# Altium project UL-SWAP-DAQ-1.PrjPcb (part 2 of 2)

## Sheet PIC32_Subsystem.SchDoc
size A; SheetNumber: 5; SheetTotal: 15
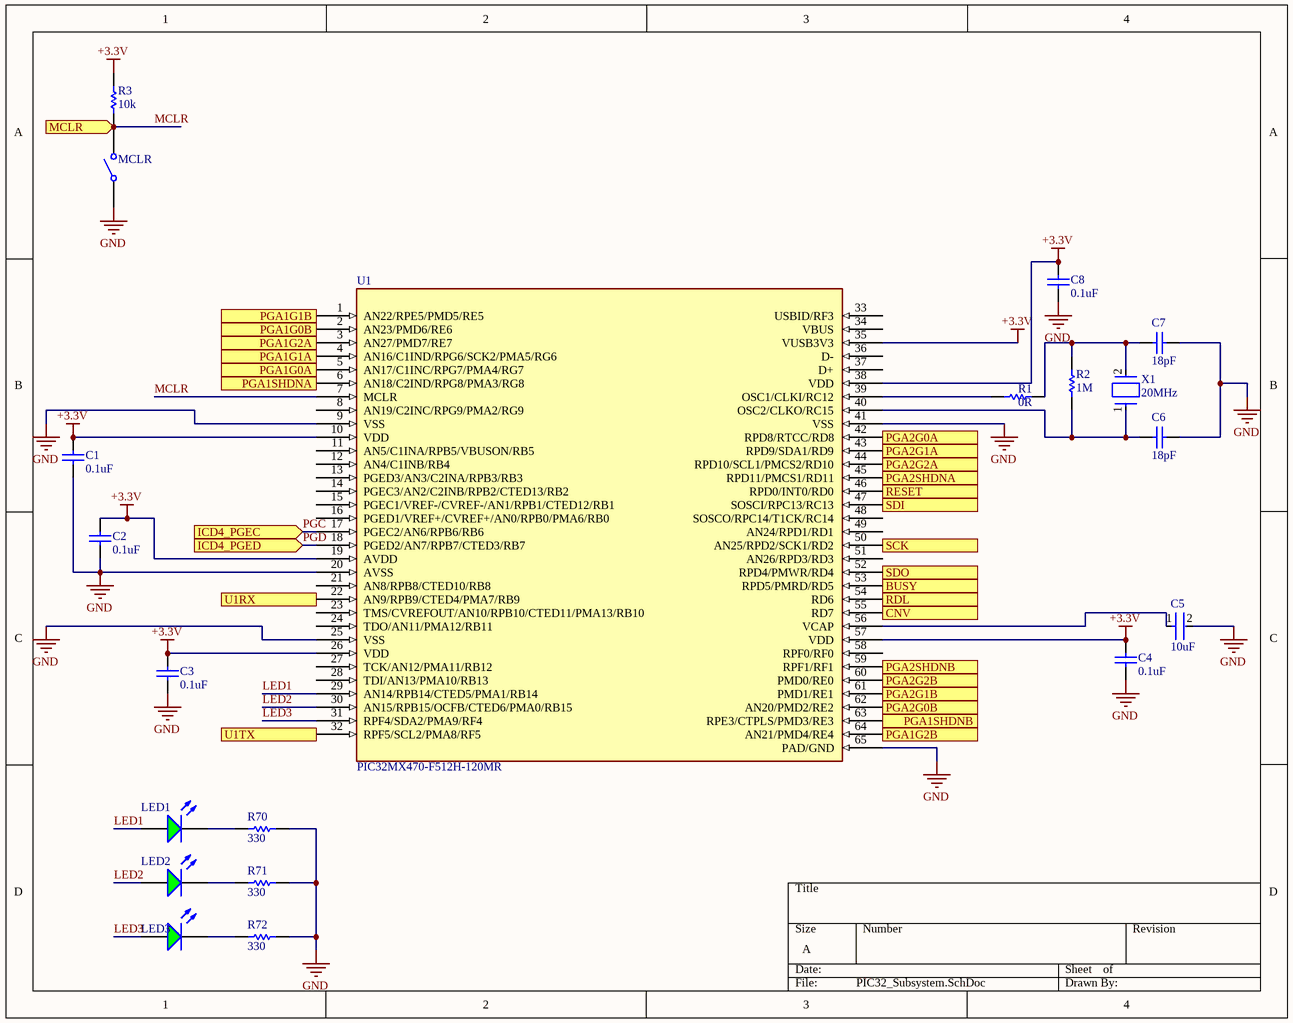
[diagram p8: PIC32_Subsystem.SchDoc]

### Parts
C1  0.1uF  [CAPC1050X55X23ML05T13]
C2  0.1uF  [CAPC1050X55X23ML05T13]
C3  0.1uF  [CAPC1050X55X23ML05T13]
C4  0.1uF  [CAPC1050X55X23ML05T13]
C5  10uF  [FP-GRM188-0_1-e0_2_0_55-IPC_A]
C6  18pF  [CAPC1005X55X25LL05T10]
C7  18pF  [CAPC1005X55X25LL05T10]
C8  0.1uF  [CAPC1050X55X23ML05T13]
LED1  (no value)  [KING-APT1608SGC_V]
LED2  (no value)  [KING-APT1608SGC_V]
LED3  (no value)  [KING-APT1608SGC_V]
MCLR  434121043816  [434121043816]  (value not drawn)
R1  0R  [RESC1005X40X25NL05T10]
R2  1M  [RESC1005X40X25LL05T05]
R3  10k  [RESC1005X40X25LL05T05]
R70  330  [RESC1609X50X30LL10T20]
R71  330  [RESC1609X50X30LL10T20]
R72  330  [RESC1609X50X30LL10T20]
U1  PIC32MX470-F512H-120MR  [TQFP]
X1  20MHz  [FP-ABM7-MFG]

### Ports
BUSY (in), CNV (out), ICD4_PGEC (in), ICD4_PGED (in), MCLR (in), PGA1G0A (out), PGA1G0B (out), PGA1G1A (out), PGA1G1B (out), PGA1G2A (out), PGA1G2B (out), PGA1SHDNA (out), PGA1SHDNB (out), PGA2G0A (out), PGA2G0B (out), PGA2G1A (out), PGA2G1B (out), PGA2G2A (out), PGA2G2B (out), PGA2SHDNA (out), PGA2SHDNB (out), RDL (out), RESET (out), SCK (out), SDI (in), SDO (out), U1RX (in), U1TX (out)

### Nets
+3.3V: C1.2 C2.2 C3.2 C4.2 C8.2 R3.2 U1.10(VDD) U1.19(AVDD) U1.26(VDD) U1.35(VUSB3V3) U1.38(VDD) U1.57(VDD)
GND: C1.1 C2.1 C3.1 C4.1 C5.2 C6.2 C7.2 C8.1 MCLR.1 R70.2 R71.2 R72.2 U1.9(VSS) U1.20(AVSS) U1.25(VSS) U1.41(VSS) U1.65(PAD/GND)
A_GP0: U1.42(RPD8/RTCC/RD8) ; port PGA2G0A
A_GP1: U1.43(RPD9/SDA1/RD9) ; port PGA2G1A
A_GP2: U1.44(RPD10/SCL1/PMCS2/RD10) ; port PGA2G2A
ADCSDI_PIC32SDO: U1.52(RPD4/PMWR/RD4) ; port SDO
ADCSDO_PIC32SDI: U1.47(SOSCI/RPC13/RC13) ; port SDI
B_GP0: U1.62(AN20/PMD2/RE2) ; port PGA2G0B
B_GP1: U1.61(PMD1/RE1) ; port PGA2G1B
B_GP2: U1.60(PMD0/RE0) ; port PGA2G2B
BUSY: U1.53(RPD5/PMRD/RD5) ; port BUSY
C_GP0: U1.2(AN23/PMD6/RE6) ; port PGA1G0B
C_GP1: U1.1(AN22/RPE5/PMD5/RE5) ; port PGA1G1B
C_GP2: U1.64(AN21/PMD4/RE4) ; port PGA1G2B
CNV: U1.55(RD7) ; port CNV
D_GP0: U1.5(AN17/C1INC/RPG7/PMA4/RG7) ; port PGA1G0A
D_GP1: U1.4(AN16/C1IND/RPG6/SCK2/PMA5/RG6) ; port PGA1G1A
D_GP2: U1.3(AN27/PMD7/RE7) ; port PGA1G2A
LED1: LED1.1(A) U1.29(AN14/RPB14/CTED5/PMA1/RB14)
LED2: LED2.1(A) U1.30(AN15/RPB15/OCFB/CTED6/PMA0/RB15)
LED3: LED3.1(A) U1.31(RPF4/SDA2/PMA9/RF4)
MCLR: MCLR.2 R3.1 U1.7(MCLR) ; port MCLR
PGC: U1.17(PGEC2/AN6/RPB6/RB6) ; port ICD4_PGEC
PGD: U1.18(PGED2/AN7/RPB7/CTED3/RB7) ; port ICD4_PGED
RDL: U1.54(RD6) ; port RDL
RESET: U1.46(RPD0/INT0/RD0) ; port RESET
SCK: U1.50(AN25/RPD2/SCK1/RD2) ; port SCK
SHDN-A: U1.45(RPD11/PMCS1/RD11) ; port PGA2SHDNA
SHDN-B: U1.59(RPF1/RF1) ; port PGA2SHDNB
SHDN-C: U1.63(RPE3/CTPLS/PMD3/RE3) ; port PGA1SHDNB
SHDN-D: U1.6(AN18/C2IND/RPG8/PMA3/RG8) ; port PGA1SHDNA
U1TX: U1.32(RPF5/SCL2/PMA8/RF5) ; port U1TX
NetC5_1: C5.1 U1.56(VCAP)
NetC6_1: C6.1 R2.1 U1.40(OSC2/CLKO/RC15) X1.1
NetC7_1: C7.1 R1.2 R2.2 X1.2
NetLED1_2: LED1.2(K) R70.1
NetLED2_2: LED2.2(K) R71.1
NetLED3_2: LED3.2(K) R72.1
NetR1_1: R1.1 U1.39(OSC1/CLKI/RC12)
NetU1_22: U1.22(AN9/RPB9/CTED4/PMA7/RB9) ; port U1RX

Not connected (* = marked no-connect by the designer): U1 8(AN19/C2INC/RPG9/PMA2/RG9) 11(AN5/C1INA/RPB5/VBUSON/RB5) 12(AN4/C1INB/RB4) 13(PGED3/AN3/C2INA/RPB3/RB3) 14(PGEC3/AN2/C2INB/RPB2/CTED13/RB2) 15(PGEC1/VREF-/CVREF-/AN1/RPB1/CTED12/RB1) 16(PGED1/VREF+/CVREF+/AN0/RPB0/PMA6/RB0) 21(AN8/RPB8/CTED10/RB8) 23(TMS/CVREFOUT/AN10/RPB10/CTED11/PMA13/RB10) 24(TDO/AN11/PMA12/RB11) 27(TCK/AN12/PMA11/RB12) 28(TDI/AN13/PMA10/RB13) 33(USBID/RF3) 34(VBUS) 36(D-) 37(D+) 48(SOSCO/RPC14/T1CK/RC14) 49(AN24/RPD1/RD1) 51(AN26/RPD3/RD3) 58(RPF0/RF0)

### Library data of the parts
C1-C4 C8 = CMP-2000-05439-1: Chip Capacitor, 100 nF, +/- 10%, 16 V, -55 to 125 degC, 0402 (1005 Metric), RoHS, Tape and Reel / CL05B104KO5NNNC; Manufacturer: Samsung Electro-Mechanics; Capacitance: 100000pF; Dielectric: X7R; Rated Voltage: 16V; Case Size/Dimension: 0402; Tolerance (%): ±10%; Manufacturer URL: http://www.samsungsem.com/global/index.jsp; Datasheet URL: https://datasheet.ciiva.com/29198/458718-da-01-en-vs-kondensator-0402-29198423.pdf; Datasheet Version: Nov-10
C5 = CMP-2006-02792-2: Chip Multilayer Ceramic Capacitors for General Purpose, 0603, 10uF, X5R, 15%, 20%, 6.3V / GRM188R60J106ME47D; Packaging: Tape and Reel; Voltage Rating (DC): 6.3V; Width: 0.031inch; Termination: SMD/SMT; Dielectric: X5R; Package Quantity: 4000; Voltage Rating: 6.3V; Capacitance: 10uF; Case/Package: 0603; Min Operating Temperature: -55°C; Voltage: 6.3V; Length: 1.6mm; Thickness: 0.035inch; Lead Free: Lead Free; Depth: 0.8mm; Case Code (Imperial): 0603; Max Operating Temperature: 85°C; Material: Ceramic; Height: 0.8mm; Tolerance: 20%; Mount: Surface Mount; REACH SVHC: No SVHC; Radiation Hardening: No; Case Code (Metric): 1608
C6 C7 = CMP-2008-04271-1: GRM1555C1H180GA01D; Manufacturer: Murata; Part Number: GRM1555C1H180GA01D
LED1-LED3 = CMP-2000-05789-1: Super Bright Green LED, 62.5 mW, 25 mA, -40 to 85 degC, 2-Pin SMD, RoHS, Tape and Reel, APT1608SGC; Manufacturer: Kingbright; Online Catalog: 0603RectanglewithFlatTopChipLEDs; Wavelength - Dominant: 568nm; Wavelength - Peak: 565nm; Voltage - Forward (Vf) (Typ): 2.2V; Lens Type: Clear; Other Names: 754-1121-2; Millicandela Rating: 15mcd; Catalog Drawings: APT1608SeriesTop / APT1608SeriesSide; Lens Style/Size: RectanglewithFlatTop,1.2mmx0.8mm; Current - Test: 20mA; 3D Model: APT1608x.sldprt / APT1608x.pro / APT1608x.igs / APT1608x.stp; Viewing Angle: 120°; Package / Case: 0603(1608Metric); Category: Optoelectronics; Package Description: 2-Pin Surface Mount Device, Body 0.8 x 1.6 mm; Mounting Type: SurfaceMount; Color: Green; Height: 0.75mm; Datasheet Version: Rev. 16B, 02/2012; Family: LEDIndication-Discrete; Manufacturer URL: http://www.kingbright.com/; Package Reference: APT1608SGC; Datasheet URL: https://datasheet.ciiva.com/2113/apt1608sgc-2113808.pdf; Mounting Technology: SurfaceMount; Packaging: Tape&Reel(TR); Standard Package: 2,000; Size / Dimension: 1.60mmLx0.80mmW
MCLR = CMP-1459-00005-1: WS-TASV SMD Tact Switch 6.0X3.5 mm; Manufacturer: Wuerth Elektronik; NoPins: 02; ComponentLink1URL: http://www.we-online.com; PartNumber: 434121043816; ComponentLink2URL: http://katalog.we-online.de/em/datasheet/434121043816.pdf; ComponentLink2Description: Datasheet; ComponentLink1Description: Manufacturer URL; PackageReference: 434121043816
R1 = CMP-1011-00001-2: RC0402JR-070RL; Manufacturer: Yageo / Phycomp; Part Number: RC0402JR-070RL
R2 = CMP-2002-00609-3: Chip Resistor, 1 MOhm, +/- 1%, 100 mW, -55 to 155 degC, 0402 (1005 Metric), RoHS, Tape and Reel / ERJ-2RKF1004X; Manufacturer: Basic Passives; Voltage Rating: 50 V; Case\/Package: 0402; Resistance: 1 MOhm; Power Rating: 100 mW; Pins: 2; Max Operating Temperature: 155 degC; ComponentLink2URL: http://industrial.panasonic.com/cdbs/www-data/pdf/RDA0000/AOA0000C86.pdf; Weight: 2.8E-05oz; ComponentLink1URL: http://www.panasonic.com/; Radiation Hardening: No; Height: 0.35 mm; Case Code (Imperial): 0402; ComponentLink2Description: Datasheet; Mount: Surface Mount; ComponentLink1Description: Manufacturer URL; REACH SVHC: Yes; PartNumber: ERJ-2RKF1004X; Length: 1 mm; Min Operating Temperature: -55 degC; Width: 0.5 mm; Package Quantity: 10000; Tolerance: 1%; PackageDescription: 2-Pin Surface Mount Device, Body 1 x 0.5 mm; RoHSCompliant: true; DatasheetVersion: 04/2015; PackageReference: 0402; Mounting Technology: Surface Mount; Case Code (Metric): 1005; Packaging: Tape and Reel
R3 = CMP-2000-07588-1: Chip Resistor, 10 KOhm, +/- 1%, 0.1 W, -55 to 155 degC, 0402 (1005 Metric), RoHS, Tape and Reel / ERJ2RKF1002X; Manufacturer: Panasonic; Power Rating: 100mW; Voltage Rating: 50V; Resistance: 10KOhm; Case\/Package: 0402; Temperature Coefficient: 100ppm\/degreesC; RoHSCompliant: True; Lead Free: LeadFree; Package Quantity: 1; Contact Plating: Tin; Length: 1mm; Radiation Hardening: No; REACH SVHC: NoSVHC; Max Operating Temperature: 155degC; Depth: 0.5mm; Case Code (Imperial): 0402; Military Standard: Not; Package Description: 2-Pin Surface Mount Device, Body 1 x 0.5 mm; Termination: SMD/SMT; Case Code (Metric): 1005; Height: 0.35mm; Packaging: TapeandReel; Voltage Rating (DC): 50V; Package Reference: 402; Number of Pins: 2; Tolerance: 1%; Mounting Technology: SurfaceMount; Width: 0.02inch; Mount: SurfaceMount; Datasheet URL: https://industrial.panasonic.com/cdbs/www-data/pdf/RDA0000/AOA0000C304.pdf; Composition: ThickFilm; Datasheet Version: 02/2017; Manufacturer URL: http://www.panasonic.com/; Max Power Dissipation: 100mW; Number of Terminations: 2; Min Operating Temperature: -55degC
R70-R72 = CMP-1012-00062-2: CRCW0603330RJNEA; Manufacturer: Vishay Dale; Part Number: CRCW0603330RJNEA
X1 = CMP-27762-013587-1: Crystal 20MHz ±20ppm 18pF SMD-2 6mm x 3.5mm / ABM7-20.000MHZ-D2Y-T; Frequency Stability: 30ppm; ESR (Equivalent Series Resistance): 50R; Contact Plating: Gold; Load Capacitance: 18pF; Tolerance: 20ppm; Length: 6mm; Frequency: 20MHz; Lead Free: Lead Free; Package Quantity: 1000; Resistor Type: Ceramic; Min Operating Temperature: -40°C; Max Operating Temperature: 85°C; Series: ABM7; Depth: 3.5mm; Width: 0.138inch; Frequency Tolerance: 20ppm; Termination: SMD/SMT; Radiation Hardening: No; Case/Package: CSMD; Height: 0.055inch; Packaging: Tape and Reel; Operating Frequency: 20 MHz; Series Resistance: 50R; Number of Pins: 2; Mount: Surface Mount

## Sheet LVDS_Driver_Subsystem.SchDoc
size A; SheetNumber: 4; SheetTotal: 16
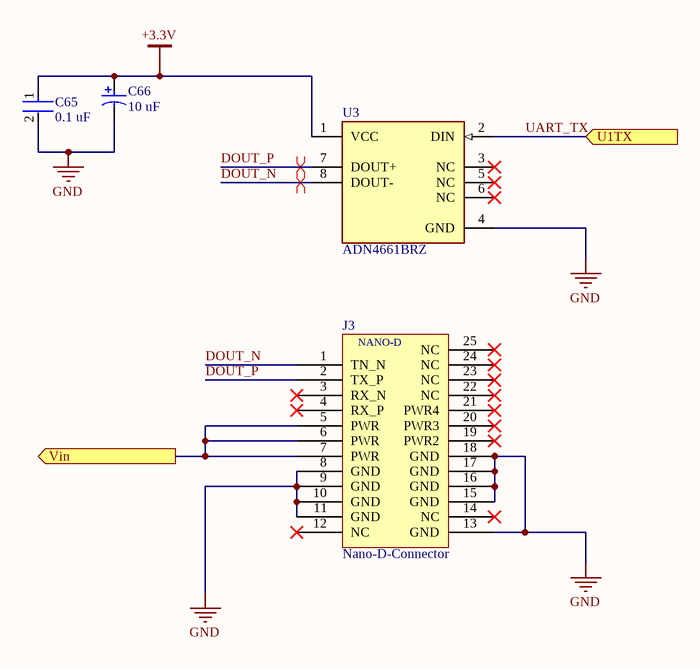
[diagram p9: LVDS_Driver_Subsystem.SchDoc]

### Parts
C65  0.1 uF  [FP-CC0603-DA-MFG]
C66  10 uF  [VISH-TR8-M_L]
J3  Nano-D-Connector  [A28400-025]
U3  ADN4661BRZ  [FP-R-8-IPC_A]

### Ports
U1TX (in), Vin (out)

### Nets
+3.3V: C65.1 C66.1 U3.1(VCC)
GND: C65.2 C66.2 J3.8(GND) J3.9(GND) J3.10(GND) J3.11(GND) J3.13(GND) J3.15(GND) J3.16(GND) J3.17(GND) J3.18(GND) U3.4(GND)
DOUT_N: J3.1(TN_N) U3.8(DOUT-)
DOUT_P: J3.2(TX_P) U3.7(DOUT+)
UART_TX: U3.2(DIN) ; port U1TX  [project net U1TX]
Vin: J3.5(PWR) J3.6(PWR) J3.7(PWR) ; port Vin

Not connected (* = marked no-connect by the designer): J3 3(RX_N)* 4(RX_P)* 12(NC)* 14(NC)* 19(PWR2)* 20(PWR3)* 21(PWR4)* 22(NC)* 23(NC)* 24(NC)* 25(NC)*; U3 3(NC)* 5(NC)* 6(NC)*

### Layout directives
differential pair: DOUT_N, DOUT_P

### Notes on the sheet
- (in symbol Nano-D-Connector) NANO-D

### Library data of the parts
C65 = CMP-2000-05002-2: CAP CER 0.1UF 16V X7R 0603 CC0603KRX7R7BB104; Manufacturer: YAGEO; Tolerance: 0.1; Value: 100 nF; Temperature Coefficient: 15%; Material: Ceramic; Voltage Rating: 16 V; Package: CC0603-DA; ComponentLink2Description: Datasheet; Octopart: https://octopart.com/cc0603krx7r7bb104-yageo-192941; Temperature Range High: +125°C; Digikey Description: CAP CER 0.1UF 16V X7R 0603; Voltage: 16 V; Device Class L2: Capacitors; Height: 0.9mm; Temperature: -55°C to +125°C; Manufacturer Part Number: CC0603KRX7R7BB104; Device Class L1: Passive Components; Device Class L3: Ceramic Capacitors; ComponentLink2URL: http://www.yageo.com/documents/recent/UPY-GPHC_X7R_6.3V-to-50V_18.pdf; Footprint Url: http://www.yageo.com/exep/pages/download/literatures/UPY-C_GEN_24.pdf; RoHS: TRUE; Temperature Range Low: -55°C; Temperature Characteristic: X7R; Lead Free: Yes; Capacitance: 100 nF; Category: Cap; Mouser Description: Multilayer Ceramic Capacitor, CC Series, 0.1 - F, - 10%, X7R, 16 V, 0603 [1608 Metric]; Automotive: No
C66 = CMP-2000-07316-1: Tantalum Capacitor, 10 uF, +/- 20%, 10 V, -55 to 125 degC, 2-Pin SMD (M), RoHS, Tape and Reel TR8M106M010C2000; Manufacturer: Vishay; Capacitance: 10µF; Featured Product: TR8SeriesMoldedMicroTan™TantalumChipCapacitors; ESR (Equivalent Series Resistance): 2Ohm; Other Names: 718-1673-6; Catalog Drawings: TR8SeriesTR8SeriesBottom; Online Catalog: MICROTAN®TR8Series; Voltage - Rated: 10V; Type: Molded; Mounting Technology: SurfaceMount; Category: Capacitors; Lifetime @ Temp.: -; Package Reference: TR8-M; Size / Dimension: 0.063"Lx0.033"W(1.60mmx0.85mm); Operating Temperature: -55°C~125°C; Mounting Type: SurfaceMount; Lead Spacing: -; Tolerance: ±20%; Standard Package: 1; Datasheet URL: http://www.vishay.com/docs/40114/tr8.pdf; Package Description: 2-Pin Surface Mount Device, Body 1.6 x 0.85 mm; Height - Seated (Max): 0.035"(0.89mm); Family: TantalumCapacitors; Manufacturer Size Code: M; Series: MICROTAN®TR8; Packaging: Digi-Reel®; Manufacturer URL: http://www.vishay.com/; Datasheet Version: 03/2016; Package / Case: 0603(1608Metric); Features: GeneralPurpose
U3 = CMP-09093-000114-1: IC DRIVER 1/0 8SOIC; Supply Current: 7mA; Number of Receivers: 1; Min Supply Voltage: 3V; Max Supply Current: 10mA; Max Supply Voltage: 3.6V; Turn-On Delay Time: 1.5ns; Data Rate: 600Mbps; Operating Supply Voltage: 3.3V; Length: 5mm; Series: -; Number of Pins: 8; REACH SVHC: No SVHC; Mount: Surface Mount; RoHS Compliant: Yes; Packaging: Rail/Tube; Nominal Supply Current: 7mA; Radiation Hardening: No; Number of Drivers: 1; Width: 4mm; Number of Elements: 1; Lead Free: Contains Lead; Operating Supply Current: 7mA; Min Operating Temperature: -40°C; Propagation Delay: 1.5ns; Package Quantity: 98; Height: 1.5mm; Case/Package: SOIC; Max Operating Temperature: 85°C

## Sheet ICD4_Interface_Module.SchDoc
size A; SheetNumber: 6; SheetTotal: 15
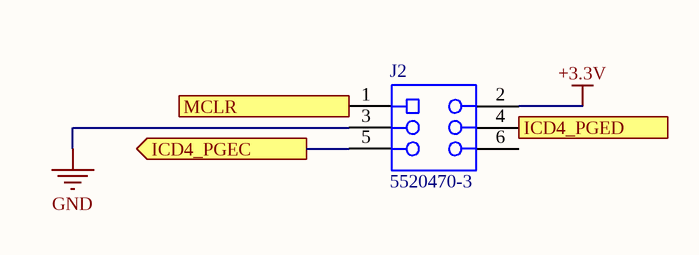
[diagram p10: ICD4_Interface_Module.SchDoc]

### Parts
J2  5520470-3  [TECO-5520470-3_V]

### Ports
ICD4_PGEC (out), ICD4_PGED (out), MCLR (out)

### Nets
+3.3V: J2.2
GND: J2.3
MCLR: J2.1 ; port MCLR
PGC: J2.5 ; port ICD4_PGEC
PGD: J2.4 ; port ICD4_PGED

Not connected (* = marked no-connect by the designer): J2 6

### Library data of the parts
J2 = CMP-1682-00001-5: Modular Jack, 6 Position, Right Angle, RoHS, Tray; Manufacturer: TE Connectivity; Voltage Rating: 150 V; Current Rating: 1.5 A; Lead Pitch: 2.54 mm; Contact Material: Bronze; RoHSCompliant: true; Contact Finish: Gold; REACH SVHC: Unknown; Height: 16.13 mm; Colour: Black; ComponentLink1Description: Manufacturer URL; PackageDescription: Female Header, Pitch 1.27 mm, 2 x 3 Position, Height 16.13 mm, Tail Length 4.32 mm; ComponentLink2URL: http://www.te.com/commerce/DocumentDelivery/DDEController?Action=srchrtrv&DocNm=5520470&DocType=Customer+Drawing&DocLang=English; ComponentLink2Description: Datasheet; Package Quantity: 176; Pins: 6; Length: 13.34 mm; Packaging: Tray; Contact Plating: Gold; Housing Material: PBT; Max Voltage Rating (AC): 150 V; ComponentLink1URL: http://www.te.com/; Mount: Through Hole; DatasheetVersion: Rev. B1, 03/2011; PackageReference: 5520470-3; Mounting Technology: Through Hole

## Sheet 403mainschematic.SchDoc
size A; SheetNumber: 7; SheetTotal: 15
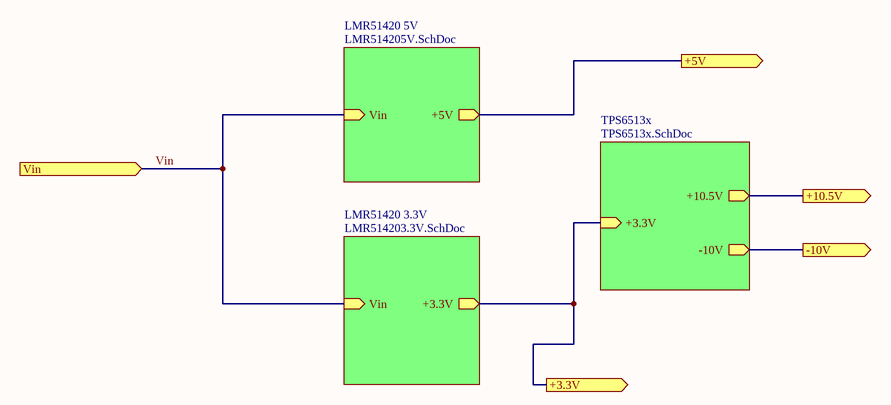
[diagram p11: 403mainschematic.SchDoc]

### Sub-sheets
LMR51420 3.3V = LMR514203.3V.SchDoc: Vin (in), +3.3V (out)
LMR51420 5V = LMR514205V.SchDoc: Vin (in), +5V (out)
TPS6513x = TPS6513x.SchDoc: +3.3V (in), +10.5V (out), -10V (out)

### Ports
+3.3V (out), +5V (out), +10.5V (out), -10V (out), Vin (in)

### Nets
+3.3V: port +3.3V, sheet LMR51420 3.3V/+3.3V, sheet TPS6513x/+3.3V
+5V: port +5V, sheet LMR51420 5V/+5V
+10.5V: port +10.5V, sheet TPS6513x/+10.5V
-10V: port -10V, sheet TPS6513x/-10V
Vin: port Vin, sheet LMR51420 3.3V/Vin, sheet LMR51420 5V/Vin

## Sheet LMR514203.3V.SchDoc
size A; SheetNumber: 10; SheetTotal: 15
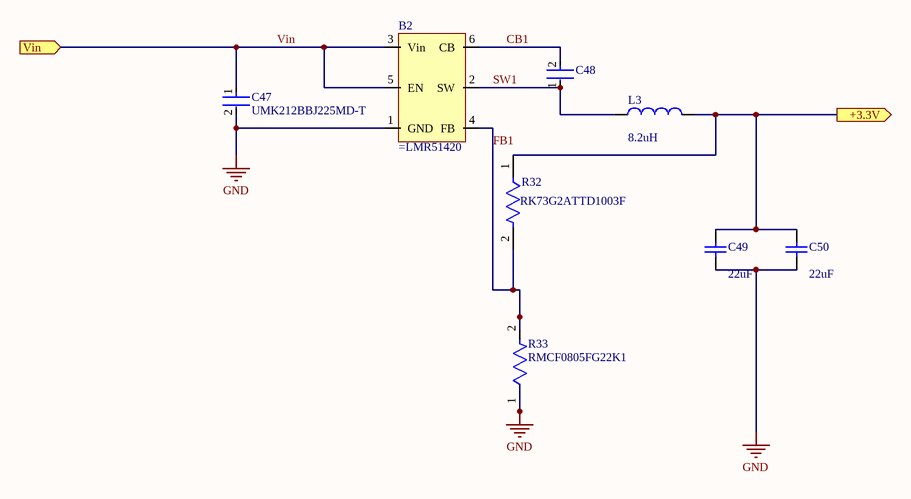
[diagram p12: LMR514203.3V.SchDoc]

### Parts
B2  (no value)  [LMR51420IC]
C47  UMK212BBJ225MD-T  [FP-0805-L_2_0_0_2-W_1_25-IPC_A]
C48  C0603C104K4PAC7867  [CAP CER 0.1UF 16V X7R 0603]  (value not drawn)
C49  value 22uF  [Cap22uF_C1206C226M4PAC7800]  (hidden comment: Comment)
C50  value 22uF  [Cap22uF_C1206C226M4PAC7800]  (hidden comment: Comment)
L3  value 8.2uH  [MSS1246H-103MED 10uH]  (hidden comment: MSS1260H-822MED)
R32  RK73G2ATTD1003F  [FP-RK73G2A-IPC_A]
R33  RMCF0805FG22K1  [FP-RMCF0805-IPC_B]

### Ports
+3.3V (out), Vin (in)

### Nets
+3.3V: C49.2 C50.2 L3.2 R32.1 ; port +3.3V
GND: B2.1(GND) C47.2 C49.1 C50.1 R33.1
CB1: B2.6(CB) C48.2
FB1: B2.4(FB) R32.2 R33.2
SW1: B2.2(SW) C48.1 L3.1
Vin: B2.3(Vin) B2.5(EN) C47.1 ; port Vin

### Library data of the parts
B2 = Component_1
C47 = CMP-14477-004278-2: Multilayer Ceramic Capacitor 2.2uF 50V X5R 20% SMD 0803 T/R; Max Operating Temperature: 85°C; Tolerance: 20%; Case Code (Imperial): 0805; Case/Package: 0805; Case Code (Metric): 2012; Capacitance: 2.2uF; Min Operating Temperature: -55°C; Mount: Surface Mount; Voltage Rating: 50V; Packaging: Tape and Reel; RoHS Compliant: Yes
C48 = b4654b650e69147ec39a6b967a45e02: CAP CER 0.1UF 16V X5R 0603; Manufacturer: KEMET; Automotive Grade: Grade 1; Value: 0.10 μF; Material: Ceramic; Temperature Coefficient: 30ppm/°C; Tolerance: 0.1; Manufacturer Part Number: C0603C104K4PAC7867; Automotive: Yes; Octopart: https://octopart.com/c0603c104k4pactu-kemet-12592163; Device Class L2: Capacitors; ComponentLink2URL: https://api.kemet.com/component-edge/download/datasheet/C0603C100J5GACAUTO.pdf; RoHS: TRUE; Height: 0.87mm; Temperature Characteristic: X5R; Voltage Rating: 16 V; Device Class L1: Passive Components; Category: Cap; Digikey Description: CAP CER 0.1UF 16V X5R 0603; Temperature Range High: +125°C; Package: C0603C-CF; Device Class L3: Ceramic Capacitors; Lead Free: Yes; Temperature: -55°C to +125°C; Temperature Range Low: -55°C; Capacitance: 0.10 μF; ComponentLink2Description: Datasheet
C49 C50 = Cap: Capacitor; Published: 8-Jun-2000; LatestRevisionDate: 17-Jul-2002; LatestRevisionNote: Re-released for DXP Platform.; PackageReference: RAD-0.3; Publisher: Altium Limited; PackageDescription: Radial Cap, Thru-Hole; 2 Leads; 0.3 in Pin Spacing
L3 = Inductor: Code_IEC: 1005; Published: 8-Jun-2000; LatestRevisionDate: 29-May-2009; LatestRevisionNote: IPC-7351 Footprint Added.; PackageReference: 0402-A; Publisher: Altium Limited; PackageDescription: Chip Inductor; Code_JEITA: 0402
R32 = CMP-04015-080178-1: 100kΩ ±1% 0.125W Chip Resistor 0805 Thick Film AEC-Q200 Qualified; Voltage Rating: 150V; Power Rating: 125mW; Temperature Coefficient: 50ppm/°C; Resistance: 100kR; Series: RK73G; Termination: SMD/SMT; Packaging: Tape and Reel; Tolerance: 1%; Case Code (Imperial): 0805; RoHS Compliant: Yes; Max Operating Temperature: 125°C; Min Operating Temperature: -55°C; Case Code (Metric): 2012
R33 = CMP-26527-006791-1: 22.1kΩ ±1% 0.125W 0805 Thick Film Chip Resistor AEC-Q200 compliant; Max Power Dissipation: 125mW; Temperature Coefficient: 100ppm/°C; Resistance: 22.1kR; Max Operating Temperature: 155°C; Length: 0.079inch; Series: RMCF; RoHS Compliant: Yes; Number of Terminations: 2; Contact Plating: Tin; Width: 0.049inch; Package Quantity: 10000; Radiation Hardening: No; Height: 0.026inch; Features: Automotive AEC-Q200; Lead Free: Lead Free; Case Code (Imperial): 0805; Packaging: Tape and Reel; Mount: Surface Mount; Case/Package: 0805; Resistor Type: Thick Film; Case Code (Metric): 2012; Min Operating Temperature: -55°C; Tolerance: 1%

## Sheet LMR514205V.SchDoc
size A; SheetNumber: 8; SheetTotal: 15
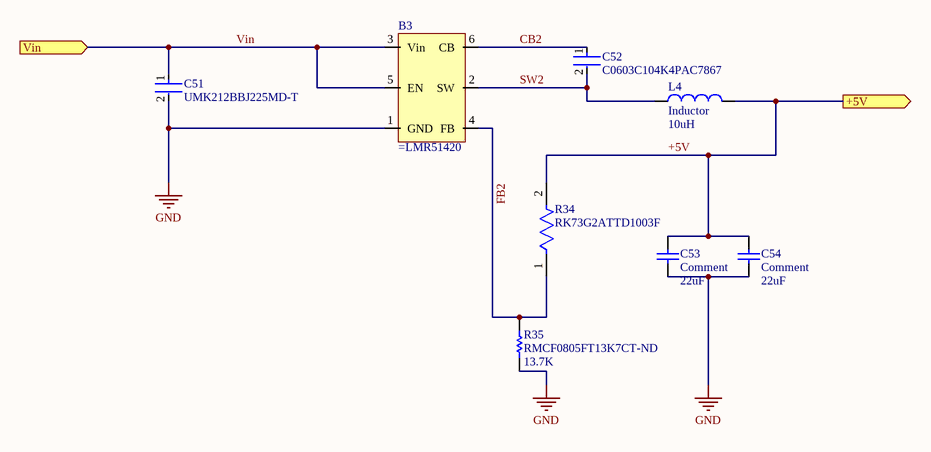
[diagram p13: LMR514205V.SchDoc]

### Parts
B3  (no value)  [LMR51420IC]
C51  UMK212BBJ225MD-T  [FP-0805-L_2_0_0_2-W_1_25-IPC_A]
C52  C0603C104K4PAC7867  [CAP CER 0.1UF 16V X7R 0603]
C53  Comment  value 22uF  [Cap22uF_C1206C226M4PAC7800]
C54  Comment  value 22uF  [Cap22uF_C1206C226M4PAC7800]
L4  Inductor  value 10uH  [MSS1246H-103MED 10uH]
R34  RK73G2ATTD1003F  [FP-RK73G2A-IPC_A]
R35  RMCF0805FT13K7CT-ND  value 13.7K  [RMCF0805FT13K7_13.7k]

### Ports
+5V (out), Vin (in)

### Nets
+5V: C53.2 C54.2 L4.2 R34.2 ; port +5V
GND: B3.1(GND) C51.2 C53.1 C54.1 R35.1
CB2: B3.6(CB) C52.1
FB2: B3.4(FB) R34.1 R35.2
SW2: B3.2(SW) C52.2 L4.1
Vin: B3.3(Vin) B3.5(EN) C51.1 ; port Vin

### Library data of the parts
B3 = Component_1
C51 = CMP-14477-004278-2: as C47 on sheet LMR514203.3V; Max Operating Temperature: 85°C; Tolerance: 20%; Case Code (Imperial): 0805; Case/Package: 0805; Case Code (Metric): 2012; Capacitance: 2.2uF; Min Operating Temperature: -55°C; Mount: Surface Mount; Voltage Rating: 50V; Packaging: Tape and Reel; RoHS Compliant: Yes
C52 = b4654b650e69147ec39a6b967a45e02: as C48 on sheet LMR514203.3V; Manufacturer Part Number: C0603C104K4PAC7867; Automotive: Yes; Octopart: https://octopart.com/c0603c104k4pactu-kemet-12592163; Device Class L2: Capacitors; ComponentLink2URL: https://api.kemet.com/component-edge/download/datasheet/C0603C100J5GACAUTO.pdf; RoHS: TRUE; Height: 0.87mm; Temperature Characteristic: X5R; Voltage Rating: 16 V; Device Class L1: Passive Components; Category: Cap; Digikey Description: CAP CER 0.1UF 16V X5R 0603; Temperature Range High: +125°C; Package: C0603C-CF; Device Class L3: Ceramic Capacitors; Lead Free: Yes; Temperature: -55°C to +125°C; Temperature Range Low: -55°C; Capacitance: 0.10 μF; ComponentLink2Description: Datasheet
C53 C54 = Cap: Capacitor; Published: 8-Jun-2000; LatestRevisionDate: 17-Jul-2002; LatestRevisionNote: Re-released for DXP Platform.; PackageReference: RAD-0.3; Publisher: Altium Limited; PackageDescription: Radial Cap, Thru-Hole; 2 Leads; 0.3 in Pin Spacing
L4 = Inductor: Code_IEC: 1005; Published: 8-Jun-2000; LatestRevisionDate: 29-May-2009; LatestRevisionNote: IPC-7351 Footprint Added.; PackageReference: 0402-A; Publisher: Altium Limited; PackageDescription: Chip Inductor; Code_JEITA: 0402
R34 = CMP-04015-080178-1: as R32 on sheet LMR514203.3V; Series: RK73G; Termination: SMD/SMT; Packaging: Tape and Reel; Tolerance: 1%; Case Code (Imperial): 0805; RoHS Compliant: Yes; Max Operating Temperature: 125°C; Min Operating Temperature: -55°C; Case Code (Metric): 2012
R35 = Res1: Resistor; Published: 8-Jun-2000; LatestRevisionDate: 17-Jul-2002; LatestRevisionNote: Re-released for DXP Platform.; PackageReference: AXIAL-0.3; Publisher: Altium Limited; PackageDescription: Axial Device, Thru-Hole; 2 Leads; 0.3 in Pin Spacing

## Sheet TPS6513x.SchDoc
size A; SheetNumber: 9; SheetTotal: 15
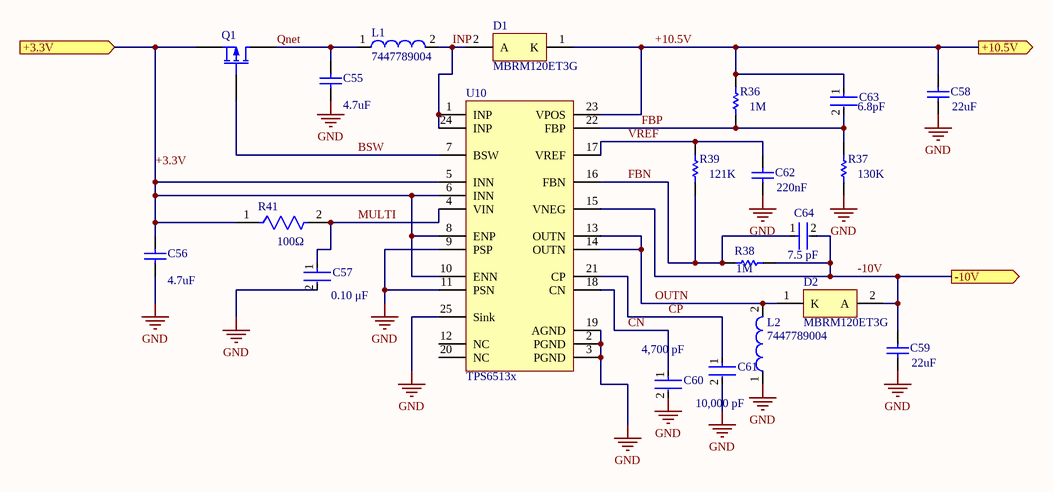
[diagram p14: TPS6513x.SchDoc]

### Parts
C55  value 4.7uF  [Yemet_0603]  (hidden comment: Comment)
C56  value 4.7uF  [Yemet_0603]  (hidden comment: Comment)
C57  value 0.10 μF  [Yemet_0603]  (hidden comment: C0402C104K8PAC)
C58  value 22uF  [GRM32ER71E226KE15K]  (hidden comment: Comment)
C59  value 22uF  [GRM32ER71E226KE15K]  (hidden comment: Comment)
C60  Capacitance: 4,700 pF  [Yemet_0603]  (hidden comment: C1206C472J5GAC)
C61  value 10,000 pF  [Yemet_0603]  (hidden comment: C0402C103J4RAC)
C62  value 220nF  [Yemet_0603]  (hidden comment: Comment)
C63  Capacitance: 6.8pF  [885012007027]  (hidden comment: CGA1A2C0G1E6R8D030BA)
C64  value 7.5 pF  [FP-C0805C-DN-MFG]  (hidden comment: C0805C759D5GACTU)
D1  MBRM120ET3G  [ONSC-POWERMITE-2-457-04_D_V]
D2  MBRM120ET3G  [ONSC-POWERMITE-2-457-04_D_V]
L1  7447789004  [WE-PD-S-PB]
L2  7447789004  [WE-PD-S-PB]
Q1  Comment  [PCBComponent_1]  (value not drawn)
R36  value 1M  [0603res_Yageo]  (hidden comment: ESR01MZPF1004)
R37  value 130K  [SFR03EZPF1303]  (hidden comment: SFR03EZPF1303)
R38  value 1M  [0603res_Yageo]  (hidden comment: Comment)
R39  value 121K  [0603res_Yageo]  (hidden comment: Comment)
R41  Resistance: 100Ω  [0603res_Yageo]  (hidden comment: AC0603FR-10100RL)
U10  TPS6513x  [TPS6513final]

### Ports
+3.3V (in), +10.5V (out), -10V (out)

### Nets
+3.3V: C56.1 Q1.3(S) R41.1 U10.5(INN) U10.6(INN) U10.8(ENP) U10.10(ENN) ; port +3.3V
GND: C55.2 C56.2 C57.2 C58.1 C59.1 C60.2 C61.2 C62.1 L2.1 R37.1 U10.2(PGND) U10.3(PGND) U10.9(PSP) U10.11(PSN) U10.19(AGND) U10.25(Sink)
+10.5V: C58.2 C63.1 D1.1(K) R36.2 U10.23(VPOS) ; port +10.5V
-10V: C59.2 C64.2 D2.2(A) R38.1 U10.15(VNEG) ; port -10V
BSW: Q1.2(G) U10.7(BSW)
CN: C60.1 U10.18(CN)
CP: C61.1 U10.21(CP)
FBN: C64.1 R38.2 R39.1 U10.16(FBN)
FBP: C63.2 R36.1 R37.2 U10.22(FBP)
INP: D1.2(A) L1.2 U10.1(INP) U10.24(INP)
MULTI: C57.1 R41.2 U10.4(VIN)
OUTN: D2.1(K) L2.2 U10.13(OUTN) U10.14(OUTN)
Qnet: C55.1 L1.1 Q1.1(D)
VREF: C62.2 R39.2 U10.17(VREF)

Not connected (* = marked no-connect by the designer): U10 12(NC) 20(NC)

### Library data of the parts
C55 C56 C58 C59 C62 = Cap: Capacitor; Published: 8-Jun-2000; LatestRevisionDate: 17-Jul-2002; LatestRevisionNote: Re-released for DXP Platform.; PackageReference: RAD-0.3; Publisher: Altium Limited; PackageDescription: Radial Cap, Thru-Hole; 2 Leads; 0.3 in Pin Spacing
C57 = b4654b650e69147ec39a6b967a45e02: C0402 0.10 μF X5R 10.00% 10 V; Manufacturer: Kemet; Voltage Rating: 10 V; Temperature Coefficient: 15%; Material: Ceramic; Tolerance: 0.1; Device Class L1: Passive Components; ComponentLink2URL: https://content.kemet.com/datasheets/KEM_C1002_X7R_SMD.pdf; Manufacturer Part Number: C0402C104K8PAC; RoHS: TRUE; Capacitance: 0.10 μF; Category: Cap; Lead Free: Yes; Octopart: https://octopart.com/c0402c104k8pac-kemet-2645080; Mouser Description: Cap-fxd 0.1UF +-10PCT 10V Cer X5R 0402 S; Device Class L2: Capacitors; Ipc Land Pattern Name: CAPC10050X50; Temperature Characteristic: X5R; Device Class L3: Ceramic Capacitors; Temperature Range High: +125°C; Package: C0402-BB; Temperature Range Low: -55°C; Automotive: No; Height: 0.55mm; ComponentLink2Description: Datasheet; Temperature: -55°C to +125°C
C60 = b4654b650e69147ec39a6b967a45e02: C1206 4,700 pF C0G 5.00% 50 V; Manufacturer: KEMET; Material: Ceramic; Automotive Grade: Grade 0; Voltage Rating: 50 V; Temperature Coefficient: 15%; Tolerance: 0.05; Ipc Land Pattern Name: CAPC320160X78; Temperature Range Low: -55°C; Temperature: -55°C to +150°C; Octopart: https://octopart.com/c1206c472j5gac-kemet-1350327; ComponentLink2Description: Datasheet; Height: 0.88mm; Device Class L2: Capacitors; Package: C1206C-EB; Device Class L3: Ceramic Capacitors; Automotive: Yes; Temperature Range High: +150°C; Temperature Characteristic: C0G; Category: Cap; Manufacturer Part Number: C1206C472J5GAC; Lead Free: Yes; Mouser Description: Multilayer Ceramic Capacitors MLCC - SMD/SMT 50volts 4700pF 5% C0G; Value: 4,700 pF; RoHS: TRUE; Device Class L1: Passive Components; ComponentLink2URL: https://content.kemet.com/datasheets/KEM_C1007_X8R_ULTRA_150C_SMD.pdf
C61 = b4654b650e69147ec39a6b967a45e02: C0402 10,000 pF X7R 5.00% 16 V; Manufacturer: Kemet; Tolerance: 0.05; Material: Ceramic; Voltage Rating: 16 V; Temperature Coefficient: 15%; Category: Cap; Manufacturer Part Number: C0402C103J4RAC; ComponentLink2URL: https://content.kemet.com/datasheets/KEM_C1002_X7R_SMD.pdf; Octopart: https://octopart.com/c0402c103j4rac-kemet-8293494; Temperature Range High: +125°C; Temperature: -55°C to +125°C; RoHS: TRUE; Device Class L1: Passive Components; Lead Free: Yes; Temperature Range Low: -55°C; Ipc Land Pattern Name: CAPC10050X50; Package: C0402-BB; Mouser Description: Multilayer Ceramic Capacitors MLCC - SMD/SMT 16volts 0.01uF 5% X7R; Temperature Characteristic: X7R; Device Class L3: Ceramic Capacitors; Height: 0.55mm; Device Class L2: Capacitors; ComponentLink2Description: Datasheet; Capacitance: 10,000 pF; Automotive: No
C63 = b4654b650e69147ec39a6b967a45e02: Cap Ceramic 6.8pF 25V C0G 0.5pF Pad SMD 0201 125°C Automotive T/R; Min Operating Temperature: -55°C; Packaging: Tape and Reel; Mount: Surface Mount; Length: 0.6mm; Dielectric: C0G; Depth: 0.3mm; Ratings: AEC-Q200; Case Code (Metric): 0603; Height: 0.3mm; Weight: 6E-06oz; Case Code (Imperial): 0201; Case/Package: 0201; Thickness: 0.013inch; Voltage Rating: 25V; Package Quantity: 1; Voltage Rating (DC): 25V; Composition: Ceramic; Max Operating Temperature: 125°C; Width: 0.012inch; Termination: SMD/SMT
C64 = CMP-1036-00734-2: CAP CER 7.5PF 50V NP0 0805; Manufacturer: KEMET; Temperature Characteristic: C0G; Tolerance: 0.5 pF; Material: Ceramic; Temperature Coefficient: 30ppm/°C; Package: C0805C-DN; Ipc Land Pattern Name: CAPC200125X78; Category: Cap; Height: 0.88mm; ComponentLink2URL: https://content.kemet.com/datasheets/KEM_C1003_C0G_SMD.pdf; Temperature: -55°C to +125°C; Device Class L3: Ceramic Capacitors; Mouser Description: Multilayer Ceramic Capacitors MLCC - SMD/SMT 50volts 7.5pF C0G 0.5%; Capacitance: 7.5 pF; Manufacturer Part Number: C0805C759D5GACTU; Lead Free: Yes; Octopart: https://octopart.com/c0805c759d5gactu-kemet-17134963; Temperature Range Low: -55°C; ComponentLink2Description: Datasheet; Voltage Rating: 50 V; Temperature Range High: +125°C; Device Class L2: Capacitors; RoHS: TRUE; Device Class L1: Passive Components; Automotive: No; Digikey Description: CAP CER 7.5PF 50V NP0 0805
D1 D2 = CMP-1055-00280-1: Schottky Power Rectifier, 2-Pin Powermite, Pb-Free, Tape and Reel; Manufacturer: On Semiconductor; Configuration: Single; IFSM Max (A): 50; Packing: Tape and Reel; ComponentLink1URL: http://www.onsemi.com/; PartNumber: MBRM120ET3G; Mounting Technology: Surface Mount; PackageReference: POWERMITE-2-457-04; DatasheetVersion: Rev. 3; ComponentLink2URL: http://www.onsemi.cn/pub_link/Collateral/MBRM120E-D.PDF; ComponentLink2Description: Datasheet; PackageVersion: Rev. F, 05/2013; ComponentLink3URL: http://www.onsemi.com/pub_link/Collateral/457-04.PDF; RoHS: TRUE; PackageDescription: 2-Pin POWERMITE, Body 1.965 x 1.9 mm; ComponentLink3Description: Package Specification; ComponentLink1Description: Manufacturer URL
L1 L2 = CMP-1396-00050-1: SMD-Shielded Power Inductor WE-PD, L=4.70 µH; Manufacturer: Wuerth Elektronik; Inductance: 4.70 ÂµH; ComponentLink2URL: http://www.we-online.de/katalog/media/pdf/7447789004.pdf; ComponentLink2Description: Datasheet; PackageDescription: SMD Inductor, 2-Leads, Body 7.3 x 7.3 mm; ComponentLink1Description: Manufacturer URL; PackageReference: WE-PD-S-PB; ComponentLink1URL: http://www.we-online.com; PartNumber: 7447789004
Q1 = MOSFET-P: P-Channel MOSFET; Published: 8-Jun-2000; LatestRevisionDate: 17-Jul-2002; LatestRevisionNote: Re-released for DXP Platform.; PackageVersion: 1995/1996; PackageReference: E3; Publisher: Altium Limited; PackageDescription: TO, Flat Index; 3 In-Line, Axial Leads; Body Dia. 4.6mm; Lead Dia. 0.5 mm (max)
R36-R39 = Res1: Resistor; Published: 8-Jun-2000; LatestRevisionDate: 17-Jul-2002; LatestRevisionNote: Re-released for DXP Platform.; PackageReference: AXIAL-0.3; Publisher: Altium Limited; PackageDescription: Axial Device, Thru-Hole; 2 Leads; 0.3 in Pin Spacing
  R38: ComponentLink1Description: New link; ComponentLink1URL: *
R41 = 1029c3af85768c4190bb7ad29bc67b5: RES 100Ω 1.00% 0.1W 0603; Tolerance: 1%; RoHS Compliant: Yes; Case/Package: 0603
U10 = TI-TPS65130RGE24-2450X2450TP: Boost Inverting Buck-Boost Voltage Converter with 2.7 to 5.5 V Input and -15 to 15 V Output, -40 to 85 degC, 24-Pin VQFN (RGE), Green (RoHS & no Sb/Br); PartNumber: TPS65130RGER; Manufacturer: Texas Instruments; Vout2(V): -15 to -2; Regulated Outputs(#): 2; Switching Frequency(Typ)(kHz): 1400; Vout(Max)(V): 15; Vin(Min)(V): 2.7; SubFamily: Step-Up Regulator; Vin(Max)(V): 5.5; Topology: Boost, Inverting Buck-Boost; ComponentLink2URL: http://www.ti.com/litv/pdf/mpqf124f; ComponentLink2Description: Package Specification; DatasheetVersion: SLVS493B; ComponentLink1Description: Datasheet; Code_JEDEC: MO-220; PackageVersion: revG, Jul-2011; ComponentLink1URL: http://www.ti.com/general/docs/lit/getliterature.tsp?genericPartNumber=TPS65130&fileType=pdf; Eco-Plan: Green (RoHS & no Sb/Br); PackageDescription: 24-Pin Plastic Quad Flatpack No-Lead, 4 x 4 mm Body, 0.5 mm Pitch; PackageReference: RGE0024B; Vout(Min)(V): -15; Mounting Technology: Surface Mount

## Nets that join several sheets
+3.3V: ADC_Subsystem (C11.2 U2.25), PIC32_Subsystem (12 pins), LVDS_Driver_Subsystem (C65.1 C66.1 U3.1), ICD4_Interface_Module (J2.2), LMR514203.3V (C49.2 C50.2 L3.2 R32.1), TPS6513x (7 pins)
+5V: THS7002CPWP_Schematic (C28.1 U4.20), LTC6362_Schematic (U6.3 U7.3), THS7002CPWP_Schematic_2 (C19.1 U5.20), LTC6362_Schematic_2 (U8.3 U9.3), ADC_Subsystem (C13.2 U2.29), LMR514205V (C53.2 C54.2 L4.2 R34.2)
GND: Capstone_Signal_Conditioners_Subsystem_Test_Schematic (J1.3 J1.8 J1.9), THS7002CPWP_Schematic (23 pins), LTC6362_Schematic (10 pins), THS7002CPWP_Schematic_2 (21 pins), LTC6362_Schematic_2 (10 pins), ADC_Subsystem (14 pins), PIC32_Subsystem (17 pins), LVDS_Driver_Subsystem (12 pins), ICD4_Interface_Module (J2.3), LMR514203.3V (5 pins), LMR514205V (5 pins), TPS6513x (16 pins)
+10.5V: THS7002CPWP_Schematic (5 pins), THS7002CPWP_Schematic_2 (5 pins), TPS6513x (5 pins)
-10V: THS7002CPWP_Schematic (6 pins), THS7002CPWP_Schematic_2 (6 pins), TPS6513x (5 pins)
A_GP0: THS7002CPWP_Schematic (R42.2 U4.28), PIC32_Subsystem (U1.42)
A_GP1: THS7002CPWP_Schematic (R43.2 U4.27), PIC32_Subsystem (U1.43)
A_GP2: THS7002CPWP_Schematic (R44.2 U4.26), PIC32_Subsystem (U1.44)
ADC_CH0_CH1_N: LTC6362_Schematic (C45.2 C46.1 R31.2), ADC_Subsystem (U2.31)
ADC_CH0_CH1_P: LTC6362_Schematic (C44.1 C45.1 R30.2), ADC_Subsystem (U2.32)
ADC_CH2_CH3_N: LTC6362_Schematic (C41.1 C42.1 R25.2), ADC_Subsystem (U2.1)
ADC_CH2_CH3_P: LTC6362_Schematic (C40.1 C41.2 R24.2), ADC_Subsystem (U2.2)
ADC_CH4_CH5_N: LTC6362_Schematic_2 (C37.2 C38.1 R19.2), ADC_Subsystem (U2.7)
ADC_CH4_CH5_P: LTC6362_Schematic_2 (C36.1 C37.1 R18.2), ADC_Subsystem (U2.8)
ADC_CH6_CH7_N: LTC6362_Schematic_2 (C34.1 C35.1 R13.2), ADC_Subsystem (U2.9)
ADC_CH6_CH7_P: LTC6362_Schematic_2 (C33.1 C34.2 R12.2), ADC_Subsystem (U2.10)
ADCSDI_PIC32SDO: ADC_Subsystem (U2.20), PIC32_Subsystem (U1.52)
ADCSDO_PIC32SDI: ADC_Subsystem (U2.22), PIC32_Subsystem (U1.47)
B_GP0: THS7002CPWP_Schematic (R46.2 U4.15), PIC32_Subsystem (U1.62)
B_GP1: THS7002CPWP_Schematic (R47.2 U4.16), PIC32_Subsystem (U1.61)
B_GP2: THS7002CPWP_Schematic (R48.2 U4.17), PIC32_Subsystem (U1.60)
BUSY: ADC_Subsystem (U2.19), PIC32_Subsystem (U1.53)
C_GP0: THS7002CPWP_Schematic_2 (R50.2 U5.28), PIC32_Subsystem (U1.2)
C_GP1: THS7002CPWP_Schematic_2 (R51.2 U5.27), PIC32_Subsystem (U1.1)
C_GP2: THS7002CPWP_Schematic_2 (R52.2 U5.26), PIC32_Subsystem (U1.64)
CNV: ADC_Subsystem (U2.16), PIC32_Subsystem (U1.55)
D_GP0: THS7002CPWP_Schematic_2 (R54.2 U5.15), PIC32_Subsystem (U1.5)
D_GP1: THS7002CPWP_Schematic_2 (R55.2 U5.16), PIC32_Subsystem (U1.4)
D_GP2: THS7002CPWP_Schematic_2 (R56.2 U5.17), PIC32_Subsystem (U1.3)
MCLR: PIC32_Subsystem (MCLR.2 R3.1 U1.7), ICD4_Interface_Module (J2.1)
PGA_A_Out: THS7002CPWP_Schematic (U4.24), LTC6362_Schematic (R27.1)
PGA_B_Out: THS7002CPWP_Schematic (U4.19), LTC6362_Schematic (R21.1)
PGA_C_Out: THS7002CPWP_Schematic_2 (U5.24), LTC6362_Schematic_2 (R15.1)
PGA_D_Out: THS7002CPWP_Schematic_2 (U5.19), LTC6362_Schematic_2 (R8.1)
PGC: PIC32_Subsystem (U1.17), ICD4_Interface_Module (J2.5)
PGD: PIC32_Subsystem (U1.18), ICD4_Interface_Module (J2.4)
RDL: ADC_Subsystem (U2.18), PIC32_Subsystem (U1.54)
RESET: ADC_Subsystem (U2.24), PIC32_Subsystem (U1.46)
SCK: ADC_Subsystem (U2.21), PIC32_Subsystem (U1.50)
Sensor_A_N: Capstone_Signal_Conditioners_Subsystem_Test_Schematic (J1.1), THS7002CPWP_Schematic (R7.1)
Sensor_A_P: Capstone_Signal_Conditioners_Subsystem_Test_Schematic (J1.2), THS7002CPWP_Schematic (R59.1)
Sensor_B: Capstone_Signal_Conditioners_Subsystem_Test_Schematic (J1.4), THS7002CPWP_Schematic (R6.1)
Sensor_C_1: Capstone_Signal_Conditioners_Subsystem_Test_Schematic (J1.6), THS7002CPWP_Schematic_2 (R65.1)
Sensor_C_2: Capstone_Signal_Conditioners_Subsystem_Test_Schematic (J1.5), THS7002CPWP_Schematic_2 (R5.1 R68.2)
Sensor_D: Capstone_Signal_Conditioners_Subsystem_Test_Schematic (J1.7), THS7002CPWP_Schematic_2 (U5.9)
SHDN-A: THS7002CPWP_Schematic (R45.2 U4.25), LTC6362_Schematic (U6.7), PIC32_Subsystem (U1.45)
SHDN-B: THS7002CPWP_Schematic (R49.2 U4.18), LTC6362_Schematic (U7.7), PIC32_Subsystem (U1.59)
SHDN-C: THS7002CPWP_Schematic_2 (R53.2 U5.25), LTC6362_Schematic_2 (U8.7), PIC32_Subsystem (U1.63)
SHDN-D: THS7002CPWP_Schematic_2 (R57.2 U5.18), LTC6362_Schematic_2 (U9.7), PIC32_Subsystem (U1.6)
U1TX: PIC32_Subsystem (U1.32), LVDS_Driver_Subsystem (U3.2)
Vin: THS7002CPWP_Schematic_2 (R68.1), LVDS_Driver_Subsystem (J3.5 J3.6 J3.7), LMR514203.3V (B2.3 B2.5 C47.1), LMR514205V (B3.3 B3.5 C51.1)